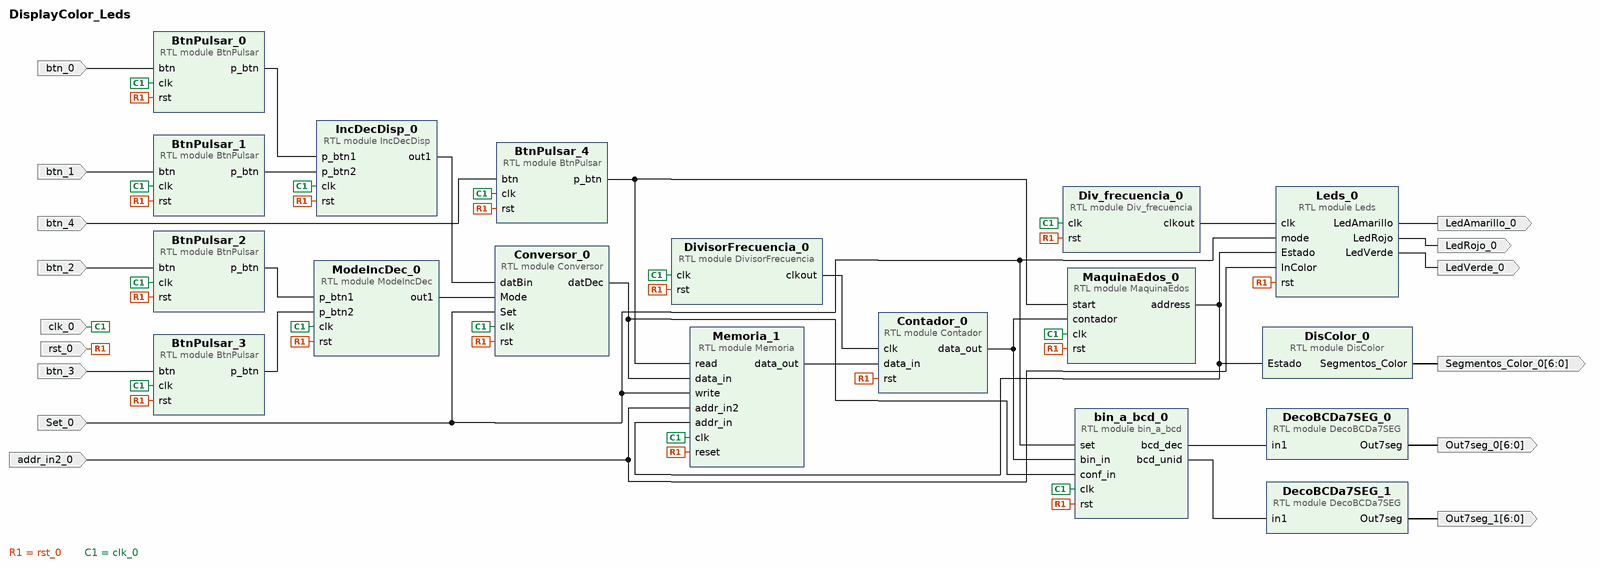
[diagram p0: block diagram of the top level]
# Vivado block design DisplayColor_Leds, xc7a100tcsg324-1, Vivado 2019.1
create_bd_design DisplayColor_Leds

create_bd_port -dir I -type rst rst_0
create_bd_port -dir I -type clk clk_0
create_bd_port -dir O LedVerde_0
create_bd_port -dir O LedAmarillo_0
create_bd_port -dir O LedRojo_0
create_bd_port -dir I Set_0
create_bd_port -dir I btn_0
create_bd_port -dir I btn_1
create_bd_port -dir I btn_2
create_bd_port -dir I btn_3
create_bd_port -dir I btn_4
create_bd_port -dir I addr_in2_0
create_bd_port -dir O -from 6 -to 0 Out7seg_0
create_bd_port -dir O -from 6 -to 0 Out7seg_1
create_bd_port -dir O -from 6 -to 0 Segmentos_Color_0

create_bd_cell -type module -reference DisColor DisColor_0
create_bd_cell -type module -reference Div_frecuencia Div_frecuencia_0
create_bd_cell -type module -reference BtnPulsar BtnPulsar_0
create_bd_cell -type module -reference BtnPulsar BtnPulsar_1
create_bd_cell -type module -reference BtnPulsar BtnPulsar_2
create_bd_cell -type module -reference BtnPulsar BtnPulsar_3
create_bd_cell -type module -reference IncDecDisp IncDecDisp_0
create_bd_cell -type module -reference ModeIncDec ModeIncDec_0
create_bd_cell -type module -reference BtnPulsar BtnPulsar_4
create_bd_cell -type module -reference Contador Contador_0
create_bd_cell -type module -reference MaquinaEdos MaquinaEdos_0
create_bd_cell -type module -reference bin_a_bcd bin_a_bcd_0
create_bd_cell -type module -reference DivisorFrecuencia DivisorFrecuencia_0
create_bd_cell -type module -reference Leds Leds_0
create_bd_cell -type module -reference DecoBCDa7SEG DecoBCDa7SEG_0
create_bd_cell -type module -reference DecoBCDa7SEG DecoBCDa7SEG_1
create_bd_cell -type module -reference Conversor Conversor_0
create_bd_cell -type module -reference Memoria Memoria_1

# ---- connections ----

connect_bd_net -net rst_0_1 [get_bd_ports rst_0] \
  [get_bd_pins Div_frecuencia_0/rst] [get_bd_pins BtnPulsar_4/rst] [get_bd_pins BtnPulsar_3/rst] \
  [get_bd_pins BtnPulsar_2/rst] [get_bd_pins BtnPulsar_1/rst] [get_bd_pins BtnPulsar_0/rst] [get_bd_pins IncDecDisp_0/rst] \
  [get_bd_pins ModeIncDec_0/rst] [get_bd_pins MaquinaEdos_0/rst] [get_bd_pins Contador_0/rst] [get_bd_pins bin_a_bcd_0/rst] \
  [get_bd_pins DivisorFrecuencia_0/rst] [get_bd_pins Leds_0/rst] [get_bd_pins Conversor_0/rst] [get_bd_pins Memoria_1/reset]
connect_bd_net [get_bd_pins Leds_0/LedVerde] [get_bd_ports LedVerde_0]
connect_bd_net [get_bd_pins Leds_0/LedAmarillo] [get_bd_ports LedAmarillo_0]
connect_bd_net [get_bd_pins Leds_0/LedRojo] [get_bd_ports LedRojo_0]
connect_bd_net [get_bd_pins BtnPulsar_0/p_btn] [get_bd_pins IncDecDisp_0/p_btn1]
connect_bd_net [get_bd_pins BtnPulsar_1/p_btn] [get_bd_pins IncDecDisp_0/p_btn2]
connect_bd_net [get_bd_pins BtnPulsar_2/p_btn] [get_bd_pins ModeIncDec_0/p_btn1]
connect_bd_net [get_bd_pins BtnPulsar_3/p_btn] [get_bd_pins ModeIncDec_0/p_btn2]
connect_bd_net [get_bd_pins IncDecDisp_0/out1] [get_bd_pins Conversor_0/datBin]
connect_bd_net [get_bd_pins ModeIncDec_0/out1] [get_bd_pins Conversor_0/Mode]
connect_bd_net -net Set_0_1 [get_bd_ports Set_0] \
  [get_bd_pins bin_a_bcd_0/set] [get_bd_pins Leds_0/mode] [get_bd_pins Conversor_0/Set] [get_bd_pins Memoria_1/write]
connect_bd_net [get_bd_pins Conversor_0/datDec] [get_bd_pins bin_a_bcd_0/conf_in] [get_bd_pins Memoria_1/data_in]
connect_bd_net [get_bd_pins BtnPulsar_4/p_btn] [get_bd_pins MaquinaEdos_0/start] [get_bd_pins Memoria_1/read]
connect_bd_net [get_bd_pins Contador_0/data_out] [get_bd_pins MaquinaEdos_0/contador] [get_bd_pins bin_a_bcd_0/bin_in]
connect_bd_net -net btn_0_1 [get_bd_ports btn_0] [get_bd_pins BtnPulsar_0/btn]
connect_bd_net -net btn_1_1 [get_bd_ports btn_1] [get_bd_pins BtnPulsar_1/btn]
connect_bd_net -net btn_2_1 [get_bd_ports btn_2] [get_bd_pins BtnPulsar_2/btn]
connect_bd_net -net btn_3_1 [get_bd_ports btn_3] [get_bd_pins BtnPulsar_3/btn]
connect_bd_net -net btn_4_1 [get_bd_ports btn_4] [get_bd_pins BtnPulsar_4/btn]
connect_bd_net [get_bd_pins DivisorFrecuencia_0/clkout] [get_bd_pins Contador_0/clk]
connect_bd_net [get_bd_pins Div_frecuencia_0/clkout] [get_bd_pins Leds_0/clk]
connect_bd_net -net clk_0_1 [get_bd_ports clk_0] \
  [get_bd_pins BtnPulsar_1/clk] [get_bd_pins BtnPulsar_0/clk] [get_bd_pins BtnPulsar_2/clk] [get_bd_pins BtnPulsar_3/clk] \
  [get_bd_pins ModeIncDec_0/clk] [get_bd_pins IncDecDisp_0/clk] [get_bd_pins BtnPulsar_4/clk] \
  [get_bd_pins DivisorFrecuencia_0/clk] [get_bd_pins bin_a_bcd_0/clk] [get_bd_pins MaquinaEdos_0/clk] \
  [get_bd_pins Div_frecuencia_0/clk] [get_bd_pins Conversor_0/clk] [get_bd_pins Memoria_1/clk]
connect_bd_net [get_bd_pins MaquinaEdos_0/address] [get_bd_pins DisColor_0/Estado] [get_bd_pins Leds_0/Estado] [get_bd_pins Memoria_1/addr_in]
connect_bd_net -net addr_in2_0_1 [get_bd_ports addr_in2_0] [get_bd_pins Leds_0/InColor] [get_bd_pins Memoria_1/addr_in2]
connect_bd_net [get_bd_pins bin_a_bcd_0/bcd_dec] [get_bd_pins DecoBCDa7SEG_0/in1]
connect_bd_net [get_bd_pins bin_a_bcd_0/bcd_unid] [get_bd_pins DecoBCDa7SEG_1/in1]
connect_bd_net [get_bd_pins DecoBCDa7SEG_0/Out7seg] [get_bd_ports Out7seg_0]
connect_bd_net [get_bd_pins DecoBCDa7SEG_1/Out7seg] [get_bd_ports Out7seg_1]
connect_bd_net [get_bd_pins DisColor_0/Segmentos_Color] [get_bd_ports Segmentos_Color_0]
connect_bd_net [get_bd_pins Memoria_1/data_out] [get_bd_pins Contador_0/data_in]

validate_bd_design
save_bd_design
